# Altium schematic sheet Control.SchDoc: Control
size A4; SheetNumber: 3; SheetTotal: 6
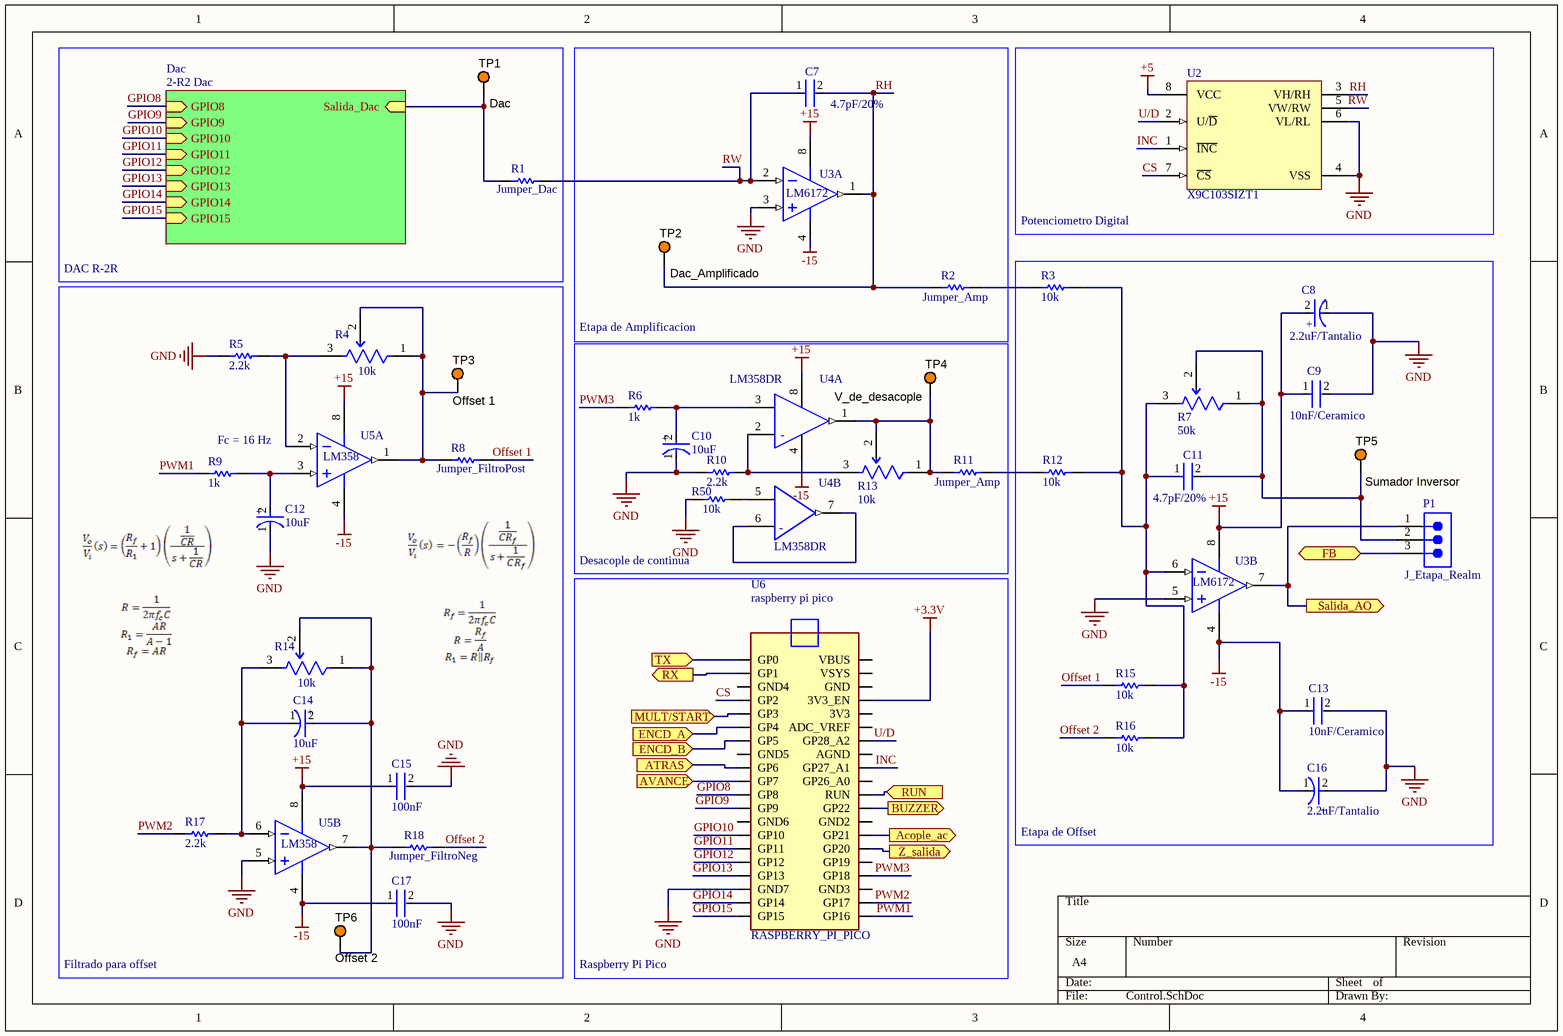
[diagram p0: Control.SchDoc]

## Parts
C7  4.7pF/20%  [FP-0805-L_2_01_0_2-W_1_25-IPC_B]
C8  2.2uF/Tantalio  [FP-T491A225K010AT-MFG]
C9  10nF/Ceramico  [FP-0805-L_2_01_0_2-W_1_25-IPC_B]
C10  10uF  [FP-RAD-TH-D_5_0_5-L_11_1-MFG]
C11  4.7pF/20%  [FP-0805-L_2_01_0_2-W_1_25-IPC_B]
C12  10uF  [FP-RAD-TH-D_5_0_5-L_11_1-MFG]
C13  10nF/Ceramico  [FP-0805-L_2_01_0_2-W_1_25-IPC_B]
C14  10uF  [FP-RAD-TH-D_5_0_5-L_11_1-MFG]
C15  100nF  [FP-0805-L_2_01_0_2-W_1_25-IPC_B]
C16  2.2uF/Tantalio  [FP-T491A225K010AT-MFG]
C17  100nF  [FP-0805-L_2_01_0_2-W_1_25-IPC_B]
P1  J_Etapa_Realm  [61300311121]
R1  Jumper_Dac  [RESC2013X50X30LL20T20]
R2  Jumper_Amp  [RESC2013X50X30LL20T20]
R3  10k  [RESC2013X50X30LL20T20]
R4  10k  [FP-3296W-MFG]
R5  2.2k  [RESC2013X50X30LL20T20]
R6  1k  [RESC2013X50X30LL20T20]
R7  50k  [FP-3296W-MFG]
R8  Jumper_FiltroPost  [RESC2013X50X30LL20T20]
R9  1k  [RESC2013X50X30LL20T20]
R10  2.2k  [RESC2013X50X30LL20T20]
R11  Jumper_Amp  [RESC2013X50X30LL20T20]
R12  10k  [RESC2013X50X30LL20T20]
R13  10k  [FP-3296W-MFG]
R14  10k  [FP-3296W-MFG]
R15  10k  [RESC2013X50X30LL20T20]
R16  10k  [RESC2013X50X30LL20T20]
R17  2.2k  [RESC2013X50X30LL20T20]
R18  Jumper_FiltroNeg  [RESC2013X50X30LL20T20]
R50  10k  [RESC2013X50X30LL20T20]
TP1  Dac  [KSTN-5003]
TP2  Dac_Amplificado  [KSTN-5003]
TP3  Offset 1  [KSTN-5003]
TP4  V_de_desacople  [KSTN-5003]
TP5  Sumador Inversor  [KSTN-5003]
TP6  Offset 2  [KSTN-5003]
U2  X9C103SIZT1  [M8_15_MFG]
U3  LM6172  [D0008A_N]  (parts A,B of 2)
U4  LM358DR  [FP-D0008A-MFG]  (parts A,B of 2)
U5  LM358  [ONSC-SOIC-8-751-07_V]  (parts A,B of 2)
U6  RASPBERRY_PI_PICO  [RASPBERRY_PI_PICO]

## Blocks framed on the sheet
DAC R-2R: R1 TP1
Etapa de Amplificacion: C7 R2 TP2 U3
Potenciometro Digital: U2
Etapa de Offset: C8 C9 C11 C13 C16 P1 R3 R7 R12 R15 R16 TP5 U3

## Sub-sheets
Dac = 2-R2 Dac: GPIO14 (in), GPIO9 (in), GPIO13 (in), GPIO8 (in), Salida_Dac (in), GPIO10 (in), GPIO11 (in), GPIO12 (in), GPIO15 (in)

## Ports
Acople_ac (out), ATRAS (in), AVANCE (in), BUZZER (out), ENCD_A (in), ENCD_B (in), FB (bidir), MULT/START (in), RUN (in), RX (out), Salida_AO (out), TX (in), Z_salida (out)

## Nets
+3.3V: U6.3V3_EN
+5: U2.8(VCC)
+15: C8.2(A) C9.1 C15.1 U3.8(V+) U4.8(V+) U5.8(VCC)
-15: C13.1 C16.1(C) C17.1 U3.4(V-) U4.4(V-) U5.4(VEE/GND)
GND: C8.1(C) C9.2 C10.1(C) C12.1(C) C13.2 C15.2 C16.2(A) C17.2 R5.1 R10.1 R50.1 U2.4(VSS) U2.6(VL/RL) U3.3(INA+) U3.5(INB+) U5.5(INB+) U6.GND7
Acople_ac: U6.GP21 ; port Acople_ac
ATRAS: U6.GP6 ; port ATRAS
AVANCE: U6.GP7 ; port AVANCE
BUZZER: U6.GP22 ; port BUZZER
CS: U2.7(~{CS}) U6.GP2
ENCD_A: U6.GP4 ; port ENCD_A
ENCD_B: U6.GP5 ; port ENCD_B
FB: P1.3 ; port FB
GPIO8: U6.GP8 ; sheet Dac/GPIO8
GPIO9: U6.GP9 ; sheet Dac/GPIO9
GPIO10: U6.GP10 ; sheet Dac/GPIO10
GPIO11: U6.GP11 ; sheet Dac/GPIO11
GPIO12: U6.GP12 ; sheet Dac/GPIO12
GPIO13: U6.GP13 ; sheet Dac/GPIO13
GPIO14: U6.GP14 ; sheet Dac/GPIO14
GPIO15: U6.GP15 ; sheet Dac/GPIO15
INC: U2.1(~{INC}) U6.GP27_A1
MULT/START: U6.GP3 ; port MULT/START
Offset 1: R8.2 R15.1
Offset 2: R16.1 R18.2
PWM1: R9.1 U6.GP16
PWM2: R17.1 U6.GP17
PWM3: R6.1 U6.GP18
RH: C7.2 R2.1 TP2.1 U2.3(VH/RH) U3.1(OUTA)
RUN: U6.RUN ; port RUN
RW: C7.1 R1.2 U2.5(VW/RW) U3.2(INA-)
RX: U6.GP1 ; port RX
Salida_AO: P1.1 U3.7(OUTB) ; port Salida_AO
TX: U6.GP0 ; port TX
U/D: U2.2(U/~{D}) U6.GP28_A2
Z_salida: U6.GP20 ; port Z_salida
NetC10_2: C10.2(A) R6.2 U4.3(IN1+)
NetC11_1: C11.1 R3.2 R7.3(CW) R12.2 R15.2 R16.2 U3.6(INB-)
NetC11_2: C11.2 P1.2 R7.1(CCW) R7.2(WIPER) TP5.1
NetC12_2: C12.2(A) R9.2 U5.3(INA+)
NetC14_1: C14.1(C) R14.3(CW) R17.2 U5.6(INB-)
NetC14_2: C14.2(A) R14.1(CCW) R14.2(WIPER) R18.1 TP6.1 U5.7(OUTB)
NetR1_1: R1.1 TP1.1 ; sheet Dac/Salida_Dac
NetR2_2: R2.2 R3.1
NetR4_1: R4.1(CCW) R4.2(WIPER) R8.1 TP3.1 U5.1(OUTA)
NetR4_3: R4.3(CW) R5.2 U5.2(INA-)
NetR10_2: R10.2 R13.3(CW) U4.2(IN1-)
NetR11_1: R11.1 R13.1(CCW) R13.2(WIPER) TP4.1 U4.1(1OUT)
NetR11_2: R11.2 R12.1
NetR50_2: R50.2 U4.5(IN2+)
NetU4_6: U4.6(IN2-) U4.7(2OUT)

Not connected (* = marked no-connect by the designer): U6 3V3 ADC_VREF AGND GND GND2 GND3 GND4 GND5 GND6 GP19 GP26_A0 VBUS VSYS

## Notes on the sheet
- Fc = 16 Hz
- Desacople de continua
- Filtrado para offset
- Raspberry Pi Pico
- (in symbol CMP-1685-00009-2, part A) -
- (in symbol CMP-1685-00009-2, part B) -
- (in symbol CMP-03017-000061-1) +
- (in symbol CMP-05427-001517-1) +
- (in symbol RASPBERRY_PI_PICO) raspberry pi pico

## Library data of the parts
C7 C9 C11 C13 C15 C17 = CMP-2007-04174-2: General Purpose Ceramic Capacitor, 0805, 100nF, 10%, X7R, 15%, 100V; Packaging: Tape and Reel; Min Operating Temperature: -55°C; Dielectric Material: Ceramic; Height: 1.4mm; Voltage Rating: 100V; Termination: SMD/SMT; Case Code (Imperial): 0805; Case Code (Metric): 2012; Case/Package: 0805; Construction: Flat; Radiation Hardening: No; Series: -; Dielectric: X7R; Package Quantity: 2000; Mount: Surface Mount; Capacitance: 100nF; Contact Plating: Tin; Voltage: 100V; Lead Free: Lead Free; Depth: 1.25mm; RoHS Compliant: Yes; Number of Pins: 2; Max Operating Temperature: 125°C; Length: 2.01mm; Voltage Rating (DC): 100V; Thickness: 0.055inch; REACH SVHC: No SVHC; Width: 0.049inch; Tolerance: 10%
C8 C16 = CMP-03017-000061-1: CAP TANT 2.2UF 10% 10V 1206; Polarity: Polar; Dissipation Factor: 6%; ESR (Equivalent Series Resistance): 8R; Ripple Current: 97mA; Dielectric Material: Tantalum; Life (Hours): 2000Hour; Leakage Current: 500nA; Max Operating Temperature: 125°C; Length: 3.2mm; Tolerance: 10%; RoHS Compliant: Yes; Packaging: Tape and Reel; Package Quantity: 1; Voltage: 10V; Voltage Rating: 10V; Height - Seated (Max): 0.071inch; Width: 1.6mm; Voltage Rating (DC): 10V; REACH SVHC: No SVHC; Lead Free: Lead Free; Features: General Purpose; Termination: SMD/SMT; Height: 1.6mm; Depth: 1.6mm; Min Operating Temperature: -55°C; Radiation Hardening: No; Mount: Surface Mount; Capacitance: 2.2uF; Case Code (Metric): 3216; Case/Package: 1206; Case Code (Imperial): 1206; Number of Pins: 2
C10 C12 C14 = CMP-05427-001517-1: Aluminum Electrolytic Capacitors (Radial Lead Type) 10uF ±20% 63V; Life (Hours): 2000Hour; Dielectric Material: Aluminium; Lead/Base Style: Straight; Ripple Current: 70mA; Dissipation Factor: 0.11%; Leakage Current: 3uA; Lead Diameter: 0.5mm; Max Operating Temperature: 85°C; Capacitance: 10uF; Voltage Rating: 63V; Packaging: Bulk; Radiation Hardening: No; Tolerance: 20%; Height: 11mm; Mount: Through Hole; Voltage: 63V; Voltage Rating (DC): 63V; Lead Pitch: 2mm; RoHS Compliant: Yes; Diameter: 5mm; Package Quantity: 200; Length: 11mm; Case/Package: Radial; Min Operating Temperature: -40°C; Construction: RADIAL; Height - Seated (Max): 0.472inch; Lead Free: Lead Free; Termination: Radial; Width: 5mm; Series: M; REACH SVHC: No SVHC
P1 = CMP-1502-01062-3: NexarPartId: 32855521; Current Rating: 3A; Voltage Rating: 250V; Number of Positions: 3; Pitch: 2.54mm; Contact Resistance: 20mΩ; Connector Type: Male Pin; Gender: Male; REACH SVHC: Unknown; Packaging: Bulk; Contact Material: Copper; Min Operating Temperature: -40°C; Number of Rows: 1; Orientation: Vertical; RoHS: Compliant; Contact Plating: Gold; Max Operating Temperature: 105°C; Mount: Through Hole; Height: 8.94mm; Operating Supply Voltage: 250V; Number of Pins: 3; Contact Mating Length: 5.9944mm; Number of Contacts: 3; Color: Black; Lead Free: Lead Free; Lead Pitch: 2.54mm; Termination: Solder
R1-R3 R5 R6 R8-R12 R15-R18 R50 = CMP-2001-04896-1: Manufacturer: Vishay Dale; Part Number: CRCW08050000Z0EA
R4 R7 R13 R14 = CMP-07234-000046-1: TRIMMER 500 OHM 0.5W PC PIN TOP; Resistance: 500R; Temperature Coefficient: 100ppm/°C; Resistance Tolerance: 10%; Number of Turns: 25; Max Power Dissipation: 500mW; Packaging: Rail/Tube; Color: Blue; Technology: CERMET; Max Operating Temperature: 125°C; RoHS Compliant: Yes; Radiation Hardening: No; Series: 3296; Military Standard: Not; Width: 9.53mm; Weight: 0.03oz; Length: 9.53mm; Package Quantity: 50; Height: 0.395inch; Min Operating Temperature: -55°C; Lead Free: Lead Free; Mount: Through Hole; Depth: 4.83mm; Termination: Pin; Taper: Linear; Contact Plating: Tin; Resistor Type: Cermet; Tolerance: 10%; REACH SVHC: No SVHC; Power Rating: 500mW
TP1-TP6 = CMP-1672-00009-1: Test Point, Orange, 1-Pin THD, RoHS; Peak Reverse Current: 600 uA; Forward Current: 3 A; Max Surge Current: 80 A; Forward Voltage: 1.08 V; Max Operating Temperature: 150 degC; PackageReference: 5003; Pins: 2; ComponentLink2URL: http://keyelco.com/userAssets/file/M65p56.pdf; PackageDescription: 1-Pin Through Hole Device, Dia 2.54 mm; Weight: 0.01 lb; Diameter: 5.3 mm; Mount: Through Hole; Package Quantity: 500; Packaging: Bulk; Min Operating Temperature: -65 degC; ComponentLink1Description: Manufacturer URL; Height: 0.25 inch; ComponentLink1URL: http://www.keyelco.com/; ComponentLink2Description: Datasheet; Width: 0.25 inch; REACH SVHC: No SVHC; RoHSCompliant: true; Radiation Hardening: No; Length: 9.5 mm; DatasheetVersion: Jun-15
U2 = CMP-00572-88253303-1: X9C103 Series 100 Tap Non Volatile 10 kOhm Digital Potentiometer - SOIC-8; Manufacturer Lifecycle Status: ACTIVE; Max Supply Current: 1mA; Resistance: 10kΩ; Operating Supply Voltage: 5V; Number of Circuits: 1; Min Supply Voltage: 4.5V; Tolerance: 20%; Pitch: 1.3mm; Interface: SPI; Memory Type: Non-Volatile; Number of Taps: 100; Max Supply Voltage: 5.5V; Temperature Coefficient: 300ppm/°C; Radiation Hardening: No; Contact Plating: Tin; ComponentLink1URL: http://www.renesas.com; Operating Supply Current: 1mA; Lead Free: Lead Free; Number of Pins: 8; Height: 0m; RoHS: Compliant; Min Input Voltage: 4.5V; Mount: Surface Mount; ComponentLink2URL: https://octopart.com/cad-content/api/get-model-datasheet/15189/88253303; ComponentLink3URL: https://www.renesas.com/en/document/psc/m815-8-lead-narrow-body-small-outline-plastic-package; Max Operating Temperature: 85°C; ComponentLink2Description: Datasheet URL; Width: 3.9mm; Length: 4.9mm; Taper: Linear; HelpURL: https://octopart.com/cad-content/api/get-model-datasheet/15189/88253303; Number of Positions: 100; Min Operating Temperature: -40°C; ComponentLink1Description: Manufacturer's Website; Max Input Voltage: 5.5V; Case/Package: SOIC; ComponentLink3Description: Manufacturer's Package Drawing; Lifecycle Status: Production
U3 = CMP-0055-00806-3: Dual High Speed, Low Power, Low Distortion Voltage Feedback Amplifiers, 8-pin Narrow SOIC, Pb-Free; Manufacturer: Texas Instruments; PackageTopMarking: NSZXTT*LM61*72IM; PowerWise: Y; Code_IPC: SOIC127P600-8; ComponentLink1Description: Datasheet URL; CompType: Amplifiers; Package Reference: D0008A; RoHS: Y; PinCount: 8; ComponentLink1URL: http://www.ti.com/general/docs/lit/getliterature.tsp?genericPartNumber=LM6172&fileType=pdf; PackageDescription: SOIC Narrow, 4.9 x 3.9 x 1.45mm, 8 Lead, 1.27mm Pitch; Code_JEDEC: MS-012-AA
U4 = CMP-1685-00009-2: IC OPAMP GP 2 CIRCUIT 8SOIC; Output Current: 30mA; Min Dual Supply Voltage: 1.5V; Input Offset Voltage (Vos): 7mV; Power Supply Rejection Ratio (PSRR): 65dB; Unity Gain Bandwidth Product: 700kHz; Number of Channels: 2; Min Supply Voltage: 3V; Max Dual Supply Voltage: 16V; Dual Supply Voltage: 9V; Max Supply Voltage: 32V; Nominal Supply Current: 1.2mA; Slew Rate: 0.3V/µs; Input Bias Current: 250nA; Voltage Gain: 100dB; Operating Supply Current: 1mA; REACH SVHC: No SVHC; Package Quantity: 2500; Width: 3.91mm; Max Operating Temperature: 70°C; Min Operating Temperature: 0°C; Mount: Surface Mount; Length: 4.9mm; Radiation Hardening: No; Case/Package: SOIC; Lead Free: Lead Free; Number of Elements: 2; Packaging: Tape and Reel; Output Current per Channel: 30mA; Number of Circuits: 2; Bandwidth: 700kHz; Operating Supply Voltage: 16V; Gain Bandwidth Product: 700kHz; Number of Pins: 8; Number of Amplifiers: 2; Height: 1.58mm; Common Mode Rejection Ratio: 65dB; Contact Plating: Gold
U5 = CMP-1310-00289-1: Single Supply Dual Operational Amplifier, 3 to 32 V, 0 to 70 degC, 8-Pin SOIC, Pb-Free, Tape and Reel; Manufacturer: On Semiconductor; PartNumber: LM358ADR2G; VCC Min (V): 3; VCC Max (V): 32; DatasheetVersion: Rev. 27; ComponentLink1URL: http://www.onsemi.com/; PackageVersion: Rev. AK, 02/2011; Packing: Tape and Reel; ComponentLink3URL: http://www.onsemi.com/pub_link/Collateral/751-07.PDF; ComponentLink2URL: http://www.onsemi.cn/pub_link/Collateral/LM358-D.PDF; Mounting Technology: Surface Mount; PackageReference: SOIC-8-751-07; PackageDescription: 8-Pin Small Outline Integrated Circuit, Body 4.9 x 3.9 mm, Pitch 1.27 mm; ComponentLink3Description: Package Specification; ComponentLink2Description: Datasheet; RoHS: TRUE; ComponentLink1Description: Manufacturer URL
U6 = RASPBERRY_PI_PICO: Raspberry Pi Board, Arm Cortex-M0+; Core Architecture:Arm; Core Sub-Architecture:Cortex-M0+; Kit Contents:Raspberry Pi Pico Board; No. Of Bits:32Bit; Silicon Core Number:Rp2040; Silicon Manufacturer:Raspberry Pi |Raspberry-Pi RASPBERRY PI PICO; SnapEDA_Link: https://www.snapeda.com/parts/RASPBERRY%20PI%20PICO/Raspberry+Pi/view-part/?ref=snap; Package: None; Value: *; MF: Raspberry Pi; MP: RASPBERRY PI PICO; Check_prices: https://www.snapeda.com/parts/RASPBERRY%20PI%20PICO/Raspberry+Pi/view-part/?ref=eda